# Altium project Rpi LED Indicator.PrjPcb
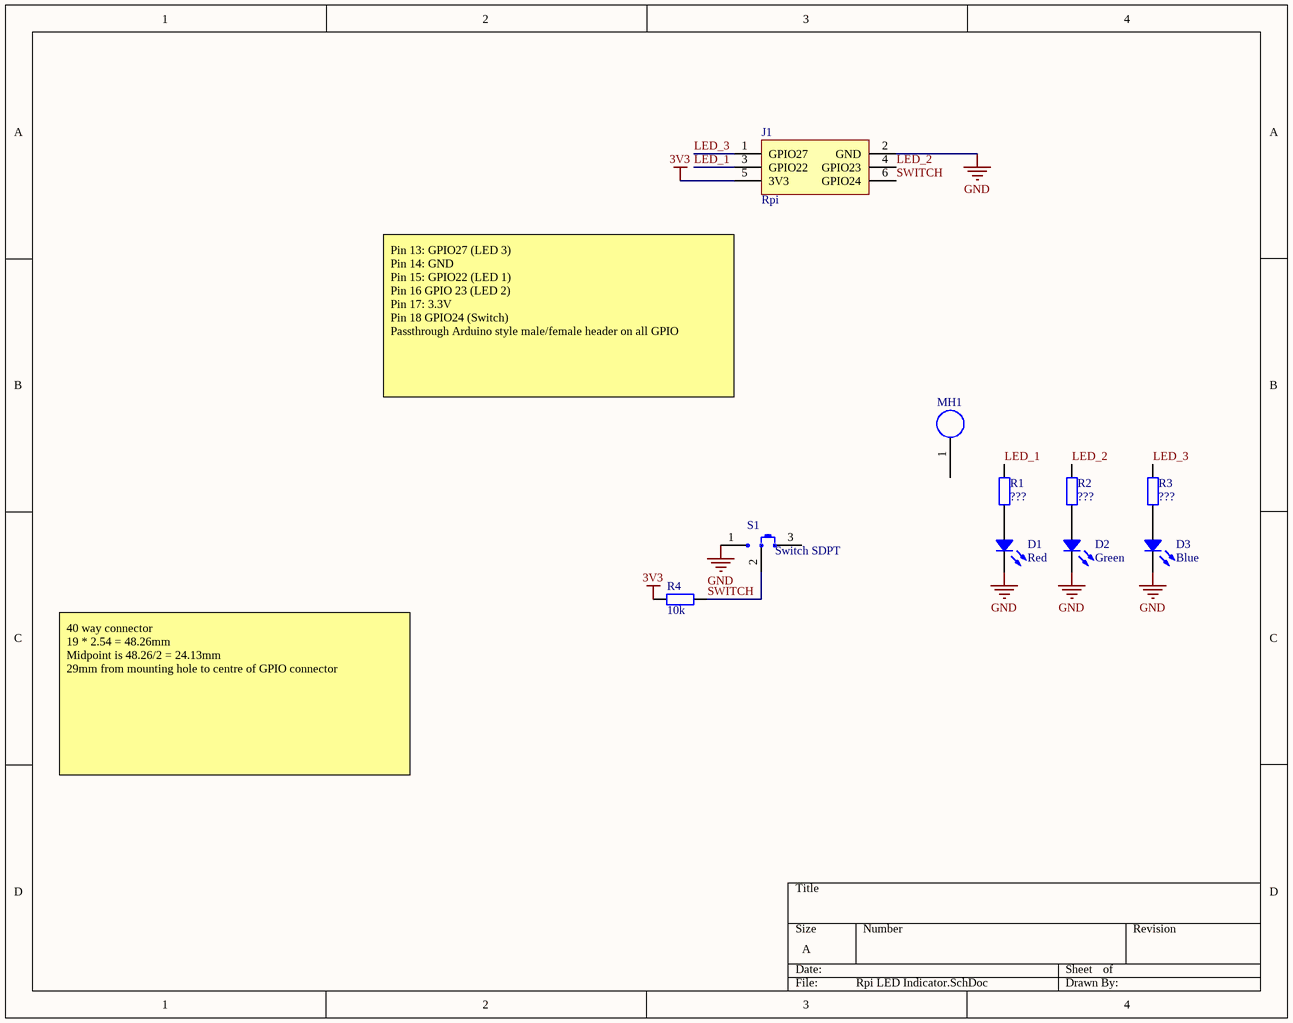
[diagram p0: Rpi LED Indicator.SchDoc]
1 sheet, 10 parts. Net scope: global (net labels, ports and power ports of the same name join across sheets).
Board file: Rpi LED Indicator.PcbDoc

## Sheet Rpi LED Indicator.SchDoc
size A; SheetNumber: 1; SheetTotal: 1; SPICEModelCacheGEHARLCN: <root> / <DocumentId>GEHARLCN</DocumentId> / </root>

### Parts
D1  Red  [LED 0603_1608 RED]
D2  Green  [LED 0603_1608 GREEN]
D3  Blue  [LED 0603_1608 BLUE]
J1  Rpi  [2.54mm header female 6POS]
MH1  AUX_1  [M2.5 Mounting Hole]  (value not drawn)
R1  value ???  [0603_R]  (hidden comment: Res 0603)
R2  value ???  [0603_R]  (hidden comment: Res 0603)
R3  value ???  [0603_R]  (hidden comment: Res 0603)
R4  value 10k  [0603_R]  (hidden comment: Res 0603)
S1  Switch SDPT  [Switch Nidec Copal CL-SB-12A-11T]

### Nets
3V3: J1.5(3V3) R4.1
GND: D1.2 D2.2 D3.2 J1.2(GND) S1.1
LED_1: J1.3(GPIO22) R1.1
LED_2: J1.4(GPIO23) R2.1
LED_3: J1.1(GPIO27) R3.1
SWITCH: J1.6(GPIO24) R4.2 S1.2(COM)
NetD1_1: D1.1 R1.2
NetD2_1: D2.1 R2.2
NetD3_1: D3.1 R3.2

Not connected (* = marked no-connect by the designer): MH1 1; S1 3

### Notes on the sheet
- Pin 13: GPIO27 (LED 3)
  Pin 14: GND
  Pin 15: GPIO22 (LED 1)
  Pin 16 GPIO 23 (LED 2)
  Pin 17: 3.3V
  Pin 18 GPIO24 (Switch)
  Passthrough Arduino style male/female header on all GPIO
- 40 way connector
  19 * 2.54 = 48.26mm
  Midpoint is 48.26/2 = 24.13mm
  29mm from mounting hole to centre of GPIO connector

### Library data of the parts
D1 = 5973005507F: LED RED 0603 SMD; Manufacturer: Dialight; Configuration: Standard; Current - Test: 20mA; Lens Color: 0.68mm; Lens Size: 1.20mm x 0.80mm; Lens Style: Rectangle with Flat Top; Millicandela Rating: 90mcd; Voltage - Forward (Vf) (Typ): 2V; Wavelength - Dominant: 630nm; Part Number: 5973005507F; Color: Red; ComponentLink1Description: Datasheet; ComponentLink1URL: http://www.dialightsignalsandcomponents.com/Assets/Drawings/2D_Drawings_DrawingDetailedSpec/NewDrawings/18369A.pdf; ComponentLink2Description: DigiKey Link; ComponentLink2URL: http://digikey.com/product-detail/en/dialight/5973005507F/350-4374-1-ND/9385480; Device Package: 0603 (1608 Metric); Height (Max): 0.68mm; LastUpdated: 2/09/2020 01:20:57; Lifecycle Status: Active; Minimum Order: 1; Mounting Type: Surface Mount; Package / Case: 0603 (1608 Metric); Packaging: TapeAndReel; PartId: 378; Part Status: Active; Price: 0.11; Series: 597; Size / Dimension: 1.60mm L x 0.80mm W; Supplier 1: DigiKey; Supplier Part Number 1: 350-4374-1-ND; Supplier Device Package: 0603; Value: Red
D2 = HSMG-C197: LED GREEN DIFFUSED CHIP SMD; Manufacturer: Broadcom Limited; Configuration: Standard; Current - Test: 20mA; Lens Color: White; Lens Size: 1.60mm x 0.80mm; Lens Style: Rectangle with Flat Top; Millicandela Rating: 15mcd; Viewing Angle: 130°; Voltage - Forward (Vf) (Typ): 2.2V; Wavelength - Dominant: 572nm; Wavelength - Peak: 570nm; Part Number: HSMG-C197; Color: Green; ComponentLink1Description: Datasheet; ComponentLink1URL: https://docs.broadcom.com/docs/AV02-0551EN; ComponentLink2Description: DigiKey Link; ComponentLink2URL: http://digikey.com/product-detail/en/broadcom-limited/HSMG-C197/516-2830-1-ND/3909267; Device Package: 0603 (1608 Metric); Height (Max): 0.40mm; LastUpdated: 21/01/2020 03:12:15; Lens Transparency: Diffused; Lifecycle Status: Active; Minimum Order: 1; Mounting Type: Surface Mount; Package / Case: 0603 (1608 Metric); Packaging: TapeAndReel; PartId: 585; Part Status: Active; Price: 0.08; Series: -; Size / Dimension: 1.60mm L x 0.80mm W; Supplier 1: DigiKey; Supplier Part Number 1: 516-2830-1-ND; Supplier Device Package: Chip LED; Value: Green
D3 = 5973604507F: LED BLUE 0603 SMD; Manufacturer: Dialight; Configuration: Standard; Current - Test: 5mA; Lens Color: 0.68mm; Lens Size: 1.20mm x 0.80mm; Lens Style: Rectangle with Flat Top; Millicandela Rating: 40mcd; Voltage - Forward (Vf) (Typ): 2.9V; Wavelength - Dominant: 470nm; Part Number: 5973604507F; Color: Blue; ComponentLink1Description: Datasheet; ComponentLink1URL: http://www.dialightsignalsandcomponents.com/Assets/Drawings/2D_Drawings_DrawingDetailedSpec/NewDrawings/C18367A.pdf; ComponentLink2Description: DigiKey Link; ComponentLink2URL: http://digikey.com/product-detail/en/dialight/5973604507F/350-4381-1-ND/9385487; Device Package: 0603 (1608 Metric); Height (Max): 0.68mm; LastUpdated: 2/09/2020 01:20:26; Lifecycle Status: Active; Minimum Order: 1; Mounting Type: Surface Mount; Package / Case: 0603 (1608 Metric); Packaging: TapeAndReel; PartId: 822; Part Status: Active; Price: 0.16; Series: 597; Size / Dimension: 1.60mm L x 0.80mm W; Supplier 1: DigiKey; Supplier Part Number 1: 350-4381-1-ND; Supplier Device Package: 0603; Value: Blue
J1 = Rpi 2x3 header
MH1 = Mounting Hole
S1 = Switch SDPT: SWITCH SLIDE SPDT
R1-R4 = Res 0603: PackageDescription: 0603 Resistor